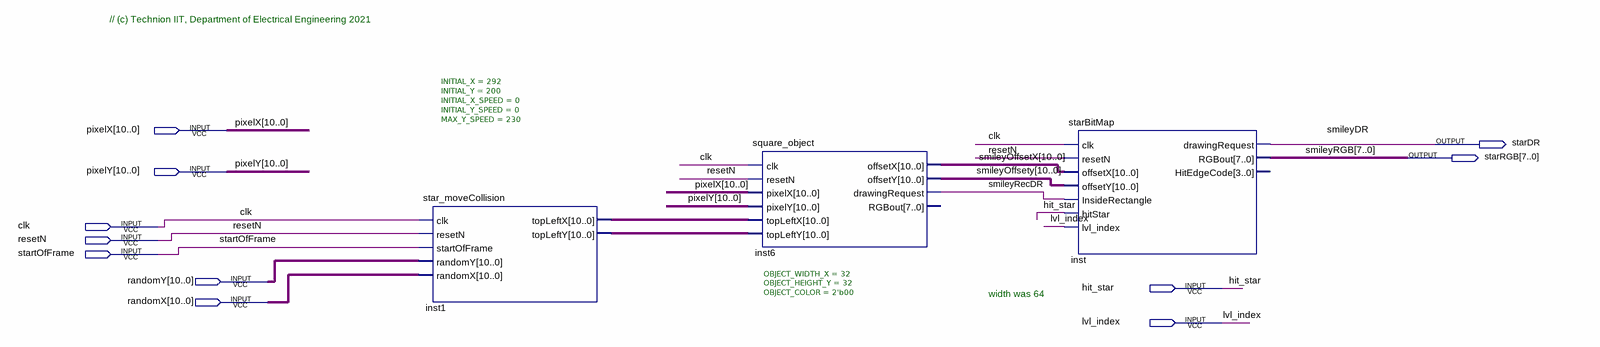
[diagram p0: schematic sheet]
// Quartus schematic Star_Block.bdf as structural Verilog: 3 symbols, 11 pins
module Star_Block (
  input  [10:0] pixelX,
  input  [10:0] pixelY,
  input  clk,
  input  resetN,
  input  startOfFrame,
  input  [10:0] randomY,
  input  hit_star,
  input  [10:0] randomX,
  input  lvl_index,
  output starDR,
  output [7:0] starRGB
);

  wire smileyRecDR;
  wire [10:0] inst1_topleftx, inst1_toplefty, smileyOffsetX, smileyOffsety;

  star_moveCollision #(.INITIAL_X(292), .INITIAL_Y(200), .INITIAL_X_SPEED(0), .INITIAL_Y_SPEED(0), .MAX_Y_SPEED(230)) inst1 (
    .clk(clk), .resetN(resetN), .startOfFrame(startOfFrame), .randomY(randomY), .randomX(randomX),
    .topLeftX(inst1_topleftx), .topLeftY(inst1_toplefty));
  square_object #(.OBJECT_WIDTH_X(32), .OBJECT_HEIGHT_Y(32), .OBJECT_COLOR(2'b00)) inst6 (
    .clk(clk), .resetN(resetN), .pixelX(pixelX), .pixelY(pixelY), .topLeftX(inst1_topleftx),
    .topLeftY(inst1_toplefty), .offsetX(smileyOffsetX), .offsetY(smileyOffsety), .drawingRequest(smileyRecDR));  // open: RGBout
  starBitMap inst (
    .clk(clk), .resetN(resetN), .offsetX(smileyOffsetX), .offsetY(smileyOffsety),
    .InsideRectangle(smileyRecDR), .hitStar(hit_star), .lvl_index(lvl_index), .drawingRequest(starDR),
    .RGBout(starRGB));  // open: HitEdgeCode

  // Other names for the same wires on the sheet: smileyDR = starDR; smileyRGB[7:0] = starRGB

  // Notes on the sheet:
  //   // (c) Technion IIT, Department of Electrical Engineering 2021
  //   width was 64
endmodule
